# EAGLE design matrix_schematic (EAGLE 6.3)
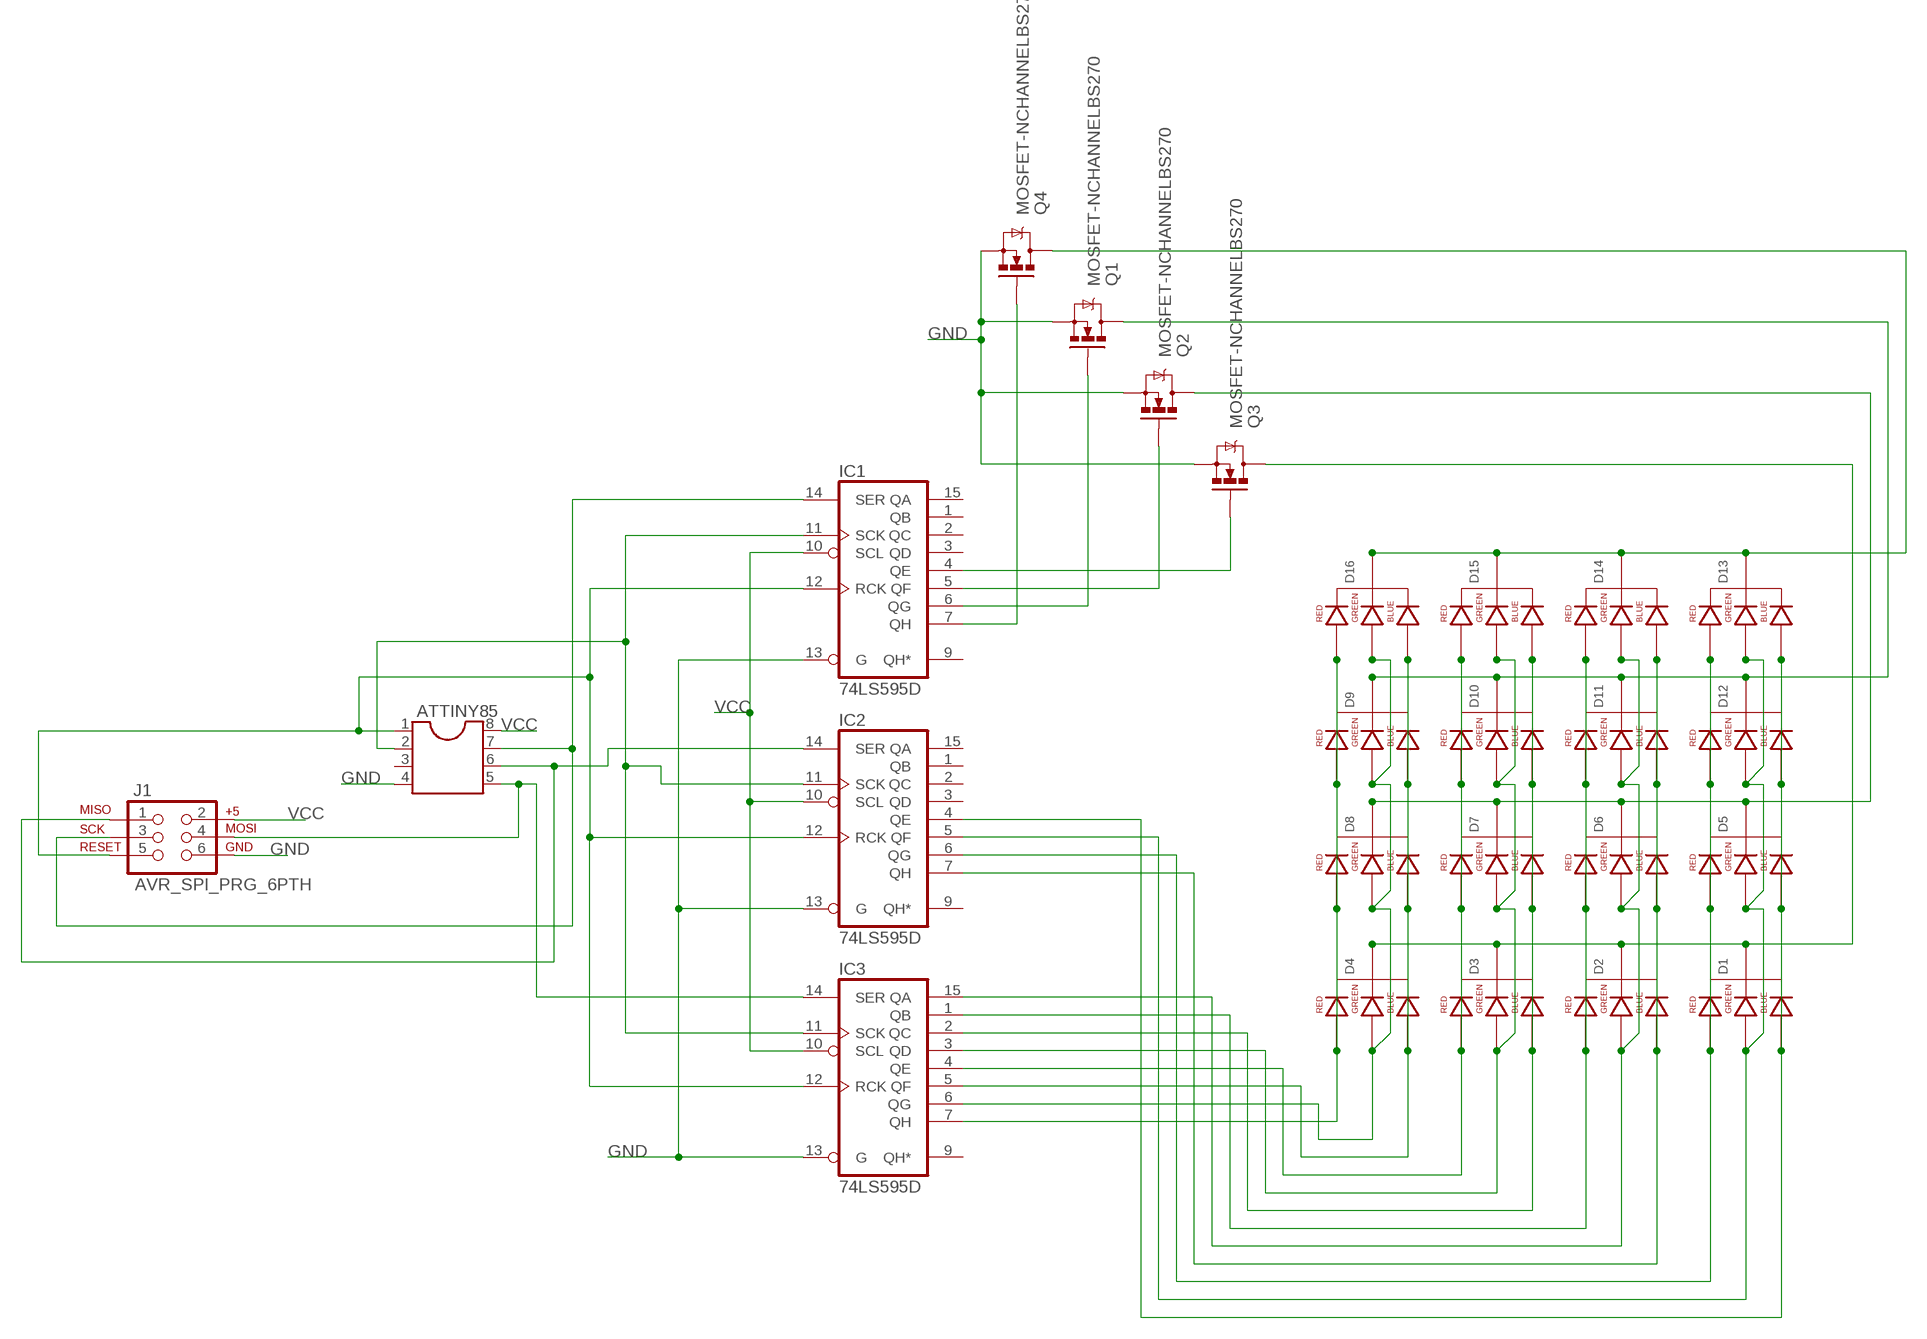
[diagram p0: schematic, sheet 1]

## Parts
ATTINY85  DIL8  [DIL08]
D1  LED-RGB-CC-THRUDIFFUSE  [LED-RGB-THRU]
D2  LED-RGB-CC-THRUDIFFUSE  [LED-RGB-THRU]
D3  LED-RGB-CC-THRUDIFFUSE  [LED-RGB-THRU]
D4  LED-RGB-CC-THRUDIFFUSE  [LED-RGB-THRU]
D5  LED-RGB-CC-THRUDIFFUSE  [LED-RGB-THRU]
D6  LED-RGB-CC-THRUDIFFUSE  [LED-RGB-THRU]
D7  LED-RGB-CC-THRUDIFFUSE  [LED-RGB-THRU]
D8  LED-RGB-CC-THRUDIFFUSE  [LED-RGB-THRU]
D9  LED-RGB-CC-THRUDIFFUSE  [LED-RGB-THRU]
D10  LED-RGB-CC-THRUDIFFUSE  [LED-RGB-THRU]
D11  LED-RGB-CC-THRUDIFFUSE  [LED-RGB-THRU]
D12  LED-RGB-CC-THRUDIFFUSE  [LED-RGB-THRU]
D13  LED-RGB-CC-THRUDIFFUSE  [LED-RGB-THRU]
D14  LED-RGB-CC-THRUDIFFUSE  [LED-RGB-THRU]
D15  LED-RGB-CC-THRUDIFFUSE  [LED-RGB-THRU]
D16  LED-RGB-CC-THRUDIFFUSE  [LED-RGB-THRU]
IC1  74LS595D  [SO16]
IC2  74LS595D  [SO16]
IC3  74LS595D  [SO16]
J1  AVR_SPI_PRG_6PTH  [2X3]
Q1  MOSFET-NCHANNELBS270  MOSFET-NCHANNELBS170  [TO-92]
Q2  MOSFET-NCHANNELBS270  MOSFET-NCHANNELBS170  [TO-92]
Q3  MOSFET-NCHANNELBS270  MOSFET-NCHANNELBS170  [TO-92]
Q4  MOSFET-NCHANNELBS270  MOSFET-NCHANNELBS170  [TO-92]

## Nets
GND: ATTINY85.4 IC1.13(G) IC2.13(G) IC3.13(G) J1.6 Q1.3(S) Q2.3(S) Q3.3(S) Q4.3(S)
N$2: ATTINY85.1 IC1.12(RCK) IC2.12(RCK) IC3.12(RCK) J1.5
N$3: ATTINY85.2 IC1.11(SCK) IC2.11(SCK) IC3.11(SCK)
N$4: D1.3(GREEN_CATHODE) D5.3(GREEN_CATHODE) D12.3(GREEN_CATHODE) D13.3(GREEN_CATHODE) IC2.5(QF)
N$6: D1.4(BLUE_CATHODE) D5.4(BLUE_CATHODE) D12.4(BLUE_CATHODE) D13.4(BLUE_CATHODE) IC2.4(QE)
N$7: D1.1(RED_CATHODE) D5.1(RED_CATHODE) D12.1(RED_CATHODE) D13.1(RED_CATHODE) IC2.6(QG)
N$8: D2.4(BLUE_CATHODE) D6.4(BLUE_CATHODE) D11.4(BLUE_CATHODE) D14.4(BLUE_CATHODE) IC2.7(QH)
N$9: D2.3(GREEN_CATHODE) D6.3(GREEN_CATHODE) D11.3(GREEN_CATHODE) D14.3(GREEN_CATHODE) IC3.15(QA)
N$10: D2.1(RED_CATHODE) D6.1(RED_CATHODE) D11.1(RED_CATHODE) D14.1(RED_CATHODE) IC3.1(QB)
N$11: D3.4(BLUE_CATHODE) D7.4(BLUE_CATHODE) D10.4(BLUE_CATHODE) D15.4(BLUE_CATHODE) IC3.2(QC)
N$14: D4.4(BLUE_CATHODE) D8.4(BLUE_CATHODE) D9.4(BLUE_CATHODE) D16.4(BLUE_CATHODE) IC3.5(QF)
N$15: D4.3(GREEN_CATHODE) D8.3(GREEN_CATHODE) D9.3(GREEN_CATHODE) D16.3(GREEN_CATHODE) IC3.6(QG)
N$16: D4.1(RED_CATHODE) D8.1(RED_CATHODE) D9.1(RED_CATHODE) D16.1(RED_CATHODE) IC3.7(QH)
N$17: D13.2(CATHODE) D14.2(CATHODE) D15.2(CATHODE) D16.2(CATHODE) Q4.1(D)
N$18: D1.2(CATHODE) D2.2(CATHODE) D3.2(CATHODE) D4.2(CATHODE) Q3.1(D)
N$19: D5.2(CATHODE) D6.2(CATHODE) D7.2(CATHODE) D8.2(CATHODE) Q2.1(D)
N$20: D9.2(CATHODE) D10.2(CATHODE) D11.2(CATHODE) D12.2(CATHODE) Q1.1(D)
N$21: ATTINY85.7 IC1.14(SER) J1.3
N$22: ATTINY85.6 IC2.14(SER) J1.1
N$23: ATTINY85.5 IC3.14(SER) J1.4
N$24: D3.3(GREEN_CATHODE) D7.3(GREEN_CATHODE) D10.3(GREEN_CATHODE) D15.3(GREEN_CATHODE) IC3.3(QD)
N$25: D3.1(RED_CATHODE) D7.1(RED_CATHODE) D10.1(RED_CATHODE) D15.1(RED_CATHODE) IC3.4(QE)
N$27: IC1.7(QH) Q4.2(G)
N$28: IC1.6(QG) Q1.2(G)
N$29: IC1.5(QF) Q2.2(G)
N$30: IC1.4(QE) Q3.2(G)
VCC: ATTINY85.8 IC1.10(SCL) IC2.10(SCL) IC3.10(SCL) J1.2
Unconnected: ATTINY85.3 IC1.1(QB) IC1.2(QC) IC1.3(QD) IC1.9(QH*) IC1.15(QA) IC2.1(QB) IC2.2(QC) IC2.3(QD) IC2.9(QH*) IC2.15(QA) IC3.9(QH*)

## Power pins joined to a net without a drawn wire
GND: IC1.8(GND) IC2.8(GND) IC3.8(GND)
VCC: IC1.16(VCC) IC2.16(VCC) IC3.16(VCC)

## Library data of the parts
ATTINY85 = ic-package:DIL8: Dual In Line / Socket
D1-D16 = SparkFun-LED:LED-RGB-CC-THRU: RGB Through-hole common cathode LED SparkFun Storefront: COM-00105 (Clear) COM-09264 (Diffuse); PROD_ID: DIO-09434
IC1-IC3 = 74xx-us:74*595: 8-bit SHIFT REGISTER, output latch
J1 = SparkFun-Connectors:AVR_SPI_PRG_6: AVR ISP 6 Pin This is the reduced ISP connector for AVR programming. Common on Arduino. This footprint will take up less PCB space and can be used with a 10-pin to 6-pin adapter such as SKU: BOB-08508
Q1-Q4 = SparkFun-DiscreteSemi:MOSFET-NCHANNEL: Common NMOSFET Parts MFG P/N Store ID Prod ID FDD8780 TRANS-09984 SI7820DN TRANS-11055 FDS6630A IC-08089 2N7002PW TRANS-11151 FQP30N06L COM-10213 TRANS-10060 BSS123LT1G TRANS-08345 BSS138 TRANS-00830 BS170 2N7000

## Board
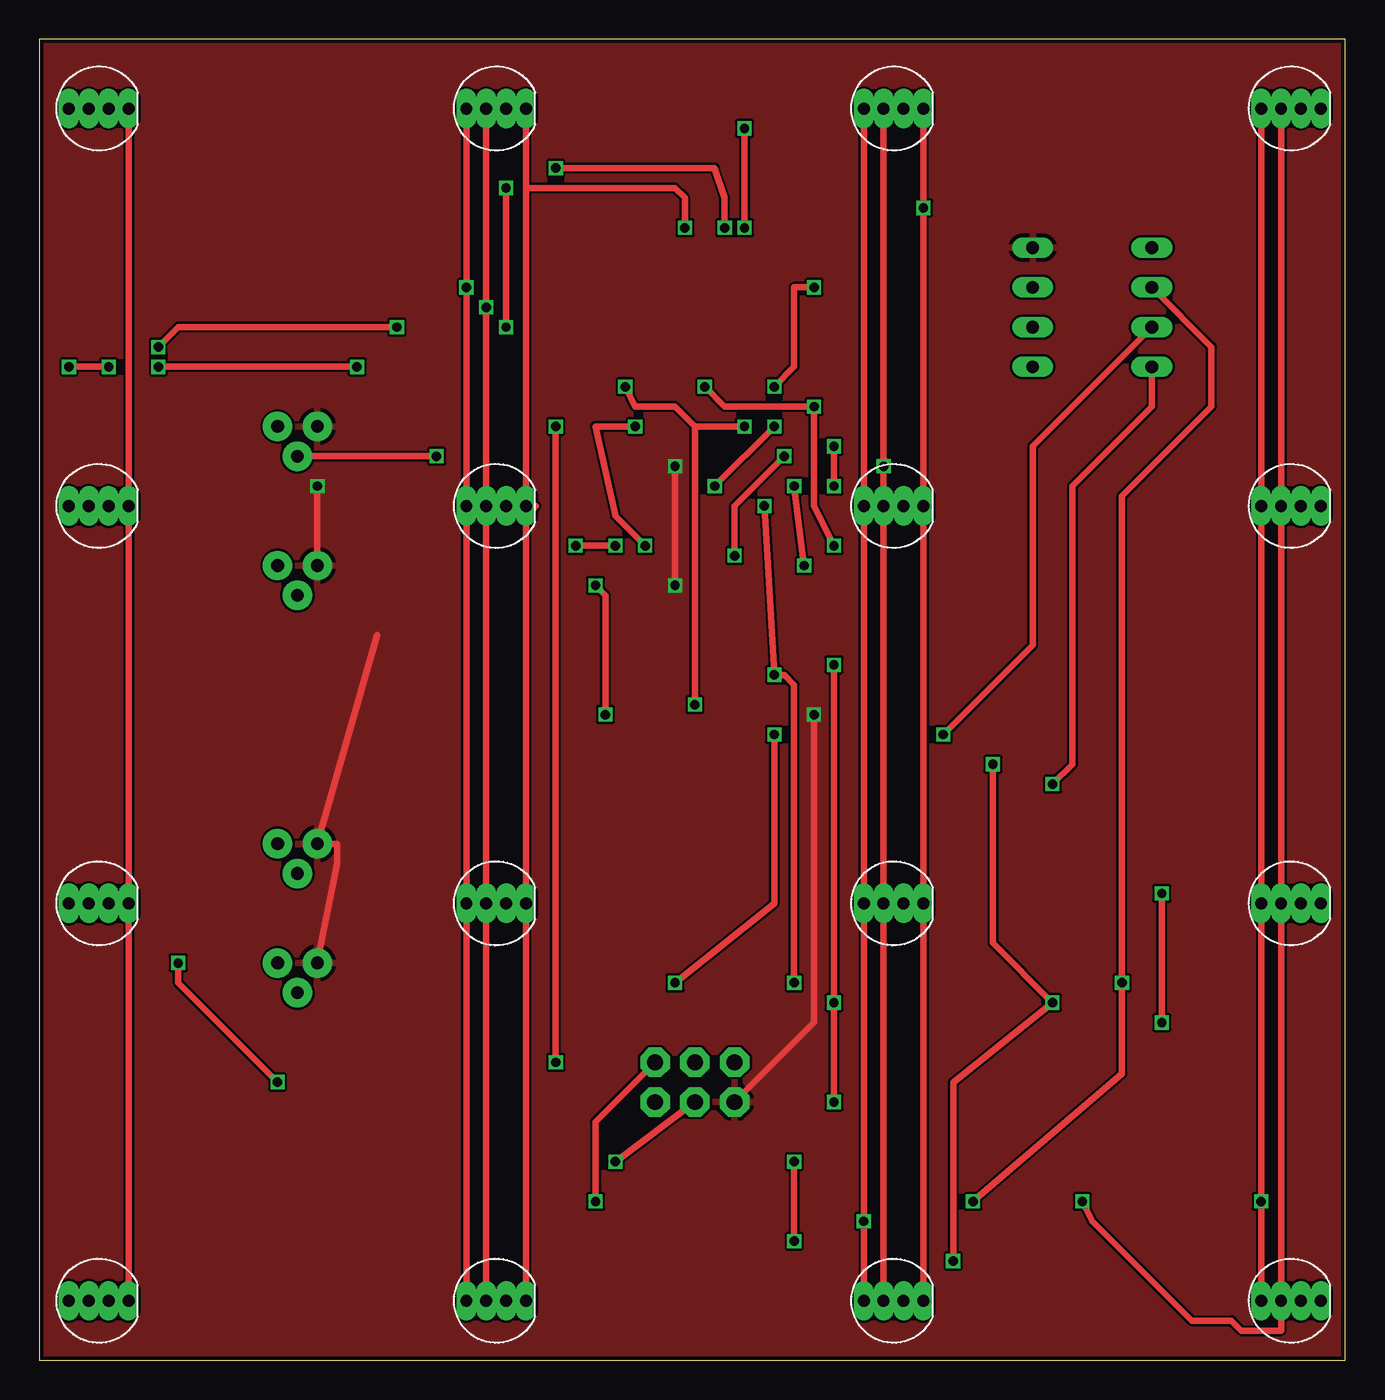
[diagram p1: board, top side]
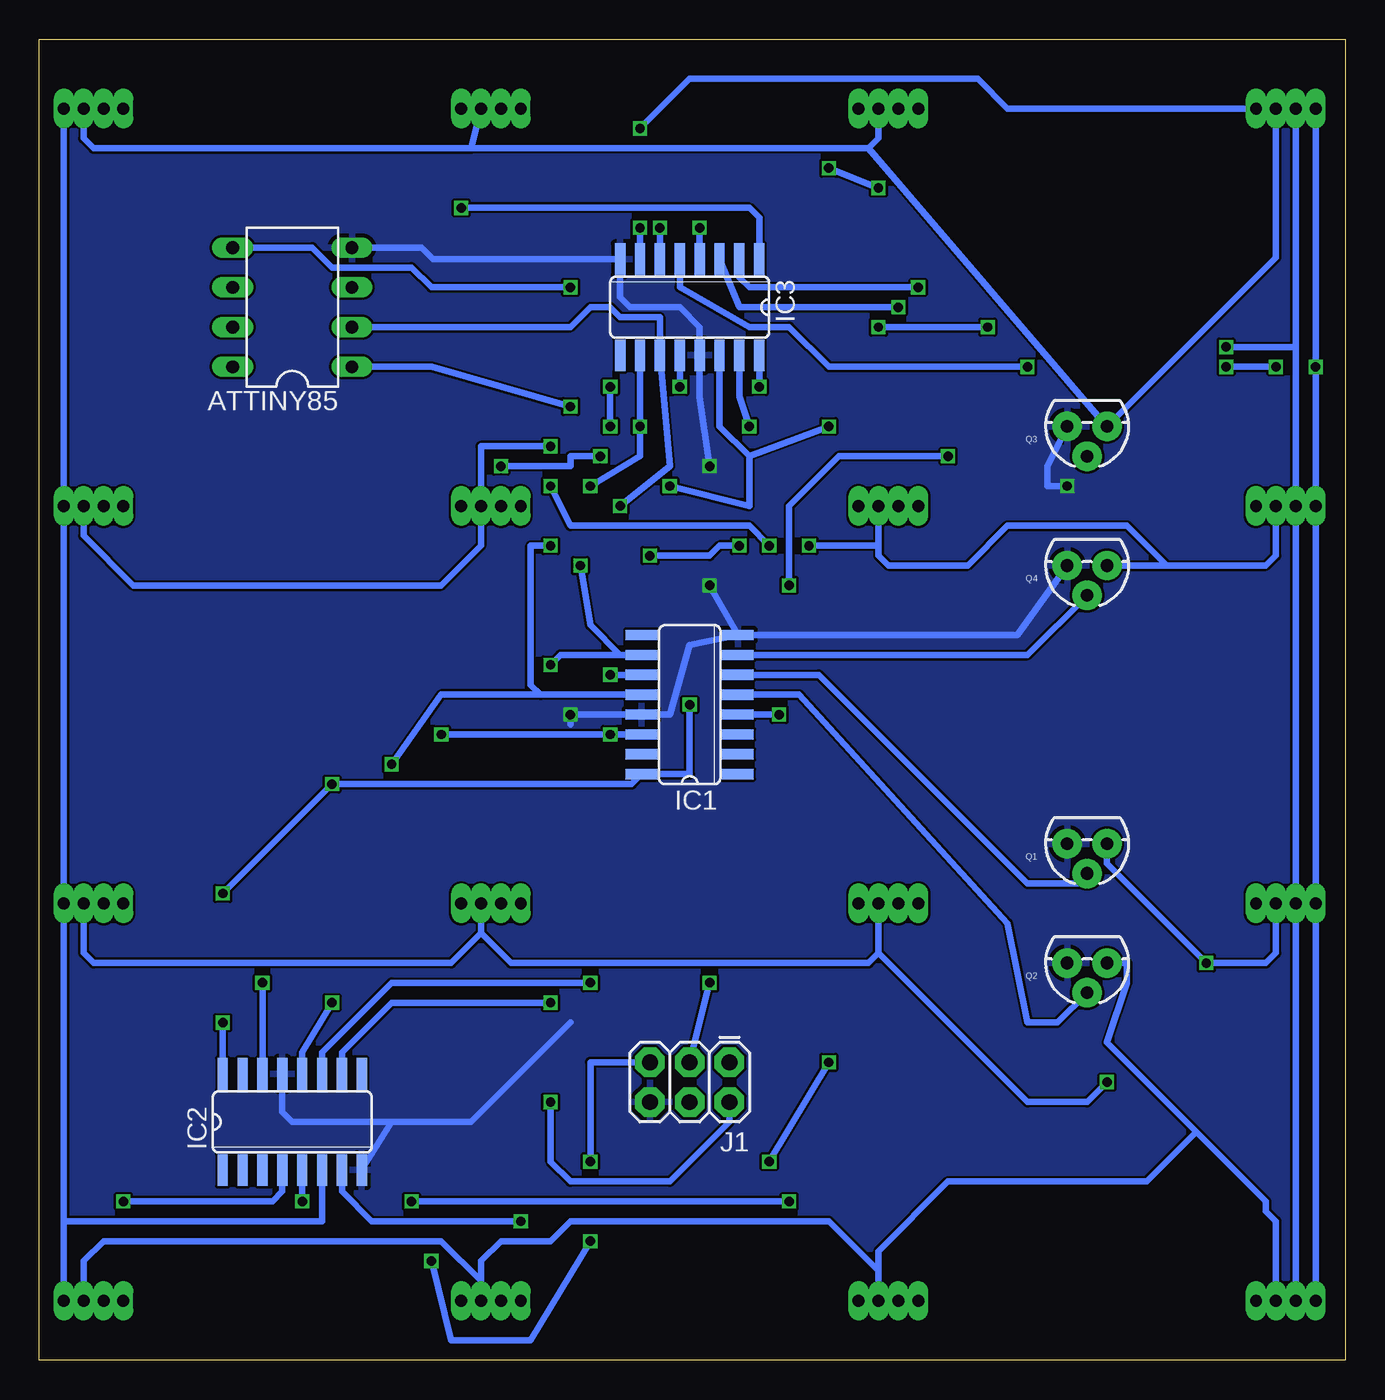
[diagram p2: board, bottom side, seen from below]

Size 83.49 x 84.44 mm. Coordinates in mm from the lower left corner, seen from the top.
Outline: 0,0 83.49,0 83.49,84.44 0,84.44 0,0
Copper layers (1*16): Top 0.035mm / dielectric 1.5mm / Bottom 0.035mm
Design rules "ITEADstudio_DRC": minimum track width 6mil, minimum drill 12mil, track to track 6mil, track to pad 6mil, pad to pad 6mil, via to via 6mil, smd to smd 0mil, copper to edge 10mil, drill to drill 10mil, minimum pad ring 10mil, minimum via ring 6mil, stop-mask expansion 2mil, vias tented up to drill 100mil, thermal gap 10mil

### Footprints (pad centres in the part's own frame; a part is rotated, then mirrored left to right if it is on the bottom)
DIL08 = drill 0.813 long: 1 -3.81,-3.81; 2 -1.27,-3.81; 3 1.27,-3.81; 4 3.81,-3.81; 5 3.81,3.81; 6 1.27,3.81; 7 -1.27,3.81; 8 -3.81,3.81
LED-RGB-THRU = drill 0.762 pad 0.889 long: 1 1.905,0; 2 0.635,0; 3 -0.635,0; 4 -1.905,0
SO16 = smd 0.66 x 2.032: 1 -4.445,-3.073; 2 -3.175,-3.073; 3 -1.905,-3.073; 4 -0.635,-3.073; 5 0.635,-3.073; 6 1.905,-3.073; 7 3.175,-3.073; 8 4.445,-3.073; 9 4.445,3.073; 10 3.175,3.073; 11 1.905,3.073; 12 0.635,3.073; 13 -0.635,3.073; 14 -1.905,3.073; 15 -3.175,3.073; 16 -4.445,3.073
2X3 = drill 1.016 pad 1.88 octagon: 1 0,0; 2 0,2.54; 3 2.54,0; 4 2.54,2.54; 5 5.08,0; 6 5.08,2.54
TO-92 = drill 0.813 pad 1.88: 1 -1.27,0; 2 0,1.905; 3 1.27,0

### Placement (x,y rotation side)
ATTINY85  67.31,67.31 90 bottom
D1  80.01,80.01 0 top
D2  54.61,80.01 0 top
D3  29.21,80.01 0 top
D4  3.81,80.01 0 top
D5  80.01,3.81 0 top
D6  54.61,3.81 0 top
D7  29.21,3.81 0 top
D8  3.81,3.81 0 top
D9  3.81,29.21 0 top
D10  29.21,29.21 0 top
D11  54.61,29.21 0 top
D12  80.01,29.21 0 top
D13  80.01,54.61 0 top
D14  54.61,54.61 0 top
D15  29.21,54.61 0 top
D16  3.81,54.61 0 top
IC1  41.91,41.91 90 bottom
IC2  67.31,15.24 0 bottom
IC3  41.91,67.31 180 bottom
J1  39.37,19.05 180 bottom
Q1  16.51,33.02 180 bottom
Q2  16.51,25.4 180 bottom
Q3  16.51,59.69 180 bottom
Q4  16.51,50.8 180 bottom

### Tracks (layer width: path | path; a pad name or v marks a point on that pad's centre or on a via)
GND  (via drill 0.6)
  Top 0.406: v49.53,41.28 49.53,21.59 J1.6 | 21.59,46.36 Q1.3 19.05,33.02 19.05,31.75 Q2.3 | Q4.3 v17.78,55.88 | v40.64,49.53 v40.64,57.15
  Bottom 0.406: IC2.13 67.94,15.88 67.31,15.24 60.96,15.24 | 60.96,15.24 55.88,15.24 49.53,21.59 | 49.53,40.64 v49.53,41.28 IC1.13 43.18,41.28 41.91,45.72 IC1.8 | IC2.8 60.96,15.24 | IC1.8 20.95,46.36 Q4.3 | v17.78,55.88 19.05,55.88 19.05,57.15 Q3.3 | IC1.8 v40.64,49.53 | v40.64,57.15 41.27,61.6 IC3.13 41.27,66.04 42.55,67.31 45.72,67.31 46.35,67.94 IC3.8 58.32,70.38 59.05,71.12 ATTINY85.4
  pour Bottom: 0,0 83.82,0 83.82,84.45 0,84.45
  pour Top: 0,0 83.82,0 83.82,84.45 0,84.45
N$2  (via drill 0.6)
  Top 0.406: v60.96,38.1 60.96,26.67 v64.77,22.86 58.42,17.78 v58.42,6.35 | v42.55,62.23 43.81,60.96 v49.53,60.96 49.53,54.61 v50.8,52.07 | v48.26,12.7 v48.26,7.62
  Bottom 0.406: IC2.12 66.67,19.68 v64.77,22.86 | v60.96,38.1 57.78,42.55 IC1.12 51.44,42.55 52.07,43.18 52.07,52.07 v50.8,52.07 | v49.53,60.96 58.42,63.5 ATTINY85.1 | v42.55,62.23 IC3.12 | J1.5 48.26,19.05 v48.26,12.7 | v48.26,7.62 52.07,1.27 57.15,1.27 v58.42,6.35
N$3  (via drill 0.6)
  Top 0.406: v48.26,24.13 48.26,43.18 47.62,43.82 v46.99,43.82 v46.35,54.61
  Bottom 0.406: IC2.11 65.41,19.68 60.96,24.13 v48.26,24.13 | v46.35,54.61 43.18,57.15 IC3.11 43.81,66.67 46.35,66.67 46.99,67.31 48.26,67.31 49.53,66.04 ATTINY85.2 | IC1.11 v46.99,43.82
N$4  (via drill 0.6)
  Top 0.406: D1.3 D13.3 D12.3 D5.3 79.38,1.91 76.83,1.91 76.2,2.54 73.66,2.54 67.31,8.89 v66.67,10.16
  Bottom 0.406: IC2.5 v66.67,10.16
N$6  (via drill 0.6)
  Top 0.406: D1.4 D13.4 D12.4 v78.11,10.16 D5.4
  Bottom 0.406: IC2.4 67.94,10.79 68.58,10.16 v78.11,10.16
N$7
  Bottom 0.406: D1.1 D13.1 D12.1 81.92,8.89 | 81.92,8.89 D5.1 | IC2.6 65.41,8.89 81.92,8.89
N$8  (via drill 0.6)
  Top 0.406: D6.4 v52.7,8.89 D11.4 D14.4 D2.4
  Bottom 0.406: IC2.7 64.14,10.79 62.23,8.89 v52.7,8.89
N$9  (via drill 0.6)
  Top 0.406: D6.3 D11.3 D14.3 v53.98,57.15 D2.3 | v38.1,59.69 35.56,59.69 36.83,53.98 v38.73,52.07 | v44.45,51.44 44.45,54.61 v47.62,57.79
  Bottom 0.406: IC3.15 38.73,61.6 v38.1,59.69 | v38.73,52.07 40.01,52.07 40.64,51.44 v44.45,51.44 | v47.62,57.79 49.53,57.79 49.53,57.15 v53.98,57.15
N$10  (via drill 0.6)
  Top 0.406: D2.1 v56.52,73.66 D14.1 D11.1 D6.1
  Bottom 0.406: IC3.1 37.47,73.02 38.1,73.66 v56.52,73.66
N$11  (via drill 0.6)
  Top 0.406: D7.4 D10.4 D15.4 v27.3,68.58 D3.4
  Bottom 0.406: IC3.2 38.73,69.21 38.1,68.58 v27.3,68.58
N$14  (via drill 0.6)
  Top 0.406: v20.32,63.5 v7.62,63.5 | v4.45,63.5 v1.91,63.5
  Bottom 0.406: D4.4 v1.91,63.5 D16.4 D9.4 D8.4 | 42.44,70.38 IC3.5 42.55,68.58 38.1,66.04 35.56,66.04 33.02,63.5 v20.32,63.5 | v7.62,63.5 v4.45,63.5
N$15  (via drill 0.6)
  Top 0.406: v43.81,72.39 43.81,74.3 43.18,76.2 v33.02,76.2 | v29.84,74.93 v29.84,66.04 | v22.86,66.04 8.89,66.04 v7.62,64.77
  Bottom 0.406: D8.3 D9.3 D16.3 3.17,64.77 | 3.17,64.77 D4.3 | IC3.6 v43.81,72.39 | v33.02,76.2 v29.84,74.93 | v29.84,66.04 v22.86,66.04 | v7.62,64.77 3.17,64.77
N$16  (via drill 0.6)
  Top 0.406: D4.1 D16.1 D9.1 D8.1 | v45.09,78.74 v45.09,72.39
  Bottom 0.406: D4.1 21.59,80.01 23.5,81.91 41.91,81.91 v45.09,78.74 | v45.09,72.39 IC3.7
N$17  (via drill 0.6)
  Top 0.406: v34.29,52.07 v36.83,52.07 | v50.8,55.88 v50.8,58.42
  Bottom 0.406: Q4.1 11.43,50.8 | 11.43,50.8 5.08,50.8 4.45,51.44 D16.2 | D15.2 29.84,52.07 | 29.84,52.07 29.84,51.44 29.21,50.8 24.13,50.8 21.59,53.34 13.97,53.34 11.43,50.8 | D13.2 80.64,52.71 77.47,49.53 57.78,49.53 55.24,52.07 D14.2 55.24,58.42 v50.8,58.42 | 29.84,52.07 v34.29,52.07 | v36.83,52.07 38.1,53.34 49.53,53.34 v50.8,55.88
N$18
  Bottom 0.406: D1.2 80.64,78.1 80.01,77.47 55.88,77.47 | 55.88,77.47 D2.2 | D3.2 29.84,78.1 30.48,77.47 | 30.48,77.47 55.88,77.47 | D4.2 4.45,70.48 Q3.1 30.48,77.47
N$19
  Bottom 0.406: Q2.1 13.97,25.4 13.97,24.13 15.24,20.32 9.53,14.61 | 9.53,14.61 5.08,10.16 5.08,9.53 4.45,8.89 D8.2 | 9.53,14.61 12.7,11.43 25.4,11.43 29.84,6.98 D7.2 29.84,5.71 33.02,8.89 49.53,8.89 50.8,7.62 53.98,7.62 55.24,6.35 D6.2 55.24,5.08 57.78,7.62 79.38,7.62 80.64,6.35 D5.2
N$20  (via drill 0.6)
  Top 0.406: v15.24,17.78 8.89,24.13 v8.89,25.4
  Bottom 0.406: 55.24,27.3 57.15,25.4 80.01,25.4 80.64,26.04 D12.2 | D11.2 55.24,27.3 | 55.24,27.3 53.34,25.4 30.48,25.4 29.84,26.04 | 29.84,26.04 D10.2 | Q1.1 15.24,31.75 v8.89,25.4 5.08,25.4 4.45,26.04 D9.2 | v15.24,17.78 16.51,16.51 20.32,16.51 29.84,26.04
N$21  (via drill 0.6)
  Top 0.406: v57.78,40.01 63.5,45.72 63.5,58.42 ATTINY85.7 | v40.64,24.13 46.99,29.21 v46.99,40.01
  Bottom 0.406: IC1.14 v46.99,40.01 v57.78,40.01 | J1.3 v40.64,24.13
N$22  (via drill 0.6)
  Top 0.406: ATTINY85.6 74.93,64.77 74.93,60.96 69.22,55.25 v69.22,24.13 IC2.14 v59.69,10.16 | J1.1 35.56,15.24 v35.56,10.16
  Bottom 0.406: IC2.14 v69.22,24.13 | v35.56,10.16 v59.69,10.16
N$23  (via drill 0.6)
  Top 0.406: v49.53,68.58 48.26,68.58 48.26,63.5 v46.99,62.23 | v46.99,59.69 v43.18,55.88 | v33.02,19.05 v33.02,59.69 | v36.83,12.7 J1.4
  Bottom 0.406: ATTINY85.5 66.04,71.12 64.77,69.85 59.69,69.85 58.42,68.58 v49.53,68.58 | v46.99,62.23 v46.99,59.69 | v43.18,55.88 38.1,54.61 38.1,57.79 | 38.1,57.79 40.01,59.69 IC3.14 | v33.02,59.69 38.1,57.79 | v33.02,19.05 v36.83,12.7
N$24  (via drill 0.6)
  Top 0.406: D3.3 v28.57,67.31 D15.3 D10.3 D7.3
  Bottom 0.406: IC3.3 38.73,67.31 v28.57,67.31
N$25  (via drill 0.6)
  Top 0.406: D7.1 D10.1 31.11,53.98 31.75,54.61 D15.1 31.11,74.93 | 31.11,74.93 D3.1 | v41.27,72.39 41.27,74.3 40.64,74.93 31.11,74.93
  Bottom 0.406: IC3.4 v41.27,72.39
N$27
  Bottom 0.406: IC1.7 20.32,45.09 Q4.2
N$28
  Bottom 0.406: IC1.6 33.66,43.82 20.32,30.48 17.14,30.48 Q1.2
N$29
  Bottom 0.406: IC1.5 34.92,42.55 21.59,27.94 20.32,21.59 18.41,21.59 Q2.2
N$30  (via drill 0.6)
  Top 0.406: Q3.2 v25.4,57.79 | v36.2,41.28 36.2,48.9 v35.56,49.53
  Bottom 0.406: v25.4,57.79 32.38,57.79 35.56,54.61 v35.56,49.53 | v36.2,41.28 IC1.4
VCC  (via drill 0.6)
  Top 0.406: v71.75,21.59 v71.75,29.84 | ATTINY85.8 71.12,60.96 66.04,55.88 66.04,38.1 v64.77,36.83 | v41.91,41.91 41.91,59.69 | 41.91,59.69 40.64,60.96 38.1,60.96 v37.47,62.23 | v48.9,50.8 v48.26,55.88 | v50.8,44.45 v50.8,22.86 v50.8,16.51 | 41.91,59.69 v45.09,59.69
  Bottom 0.406: IC2.16 v71.75,21.59 | v71.75,29.84 v64.77,36.83 45.62,36.83 IC1.16 41.91,37.47 v41.91,41.91 | v37.47,62.23 IC3.16 | IC3.10 v45.09,59.69 45.09,57.79 v48.26,55.88 | IC1.10 46.35,45.09 | 46.35,45.09 48.26,46.99 v48.9,50.8 | 46.35,45.09 50.16,45.09 v50.8,44.45 | v50.8,22.86 60.96,22.86 64.14,19.68 IC2.10 | J1.2 39.37,15.24 43.18,11.43 49.53,11.43 50.8,12.7 v50.8,16.51